# EAGLE design Tractive System Light Control Board (EAGLE 7.3.0)
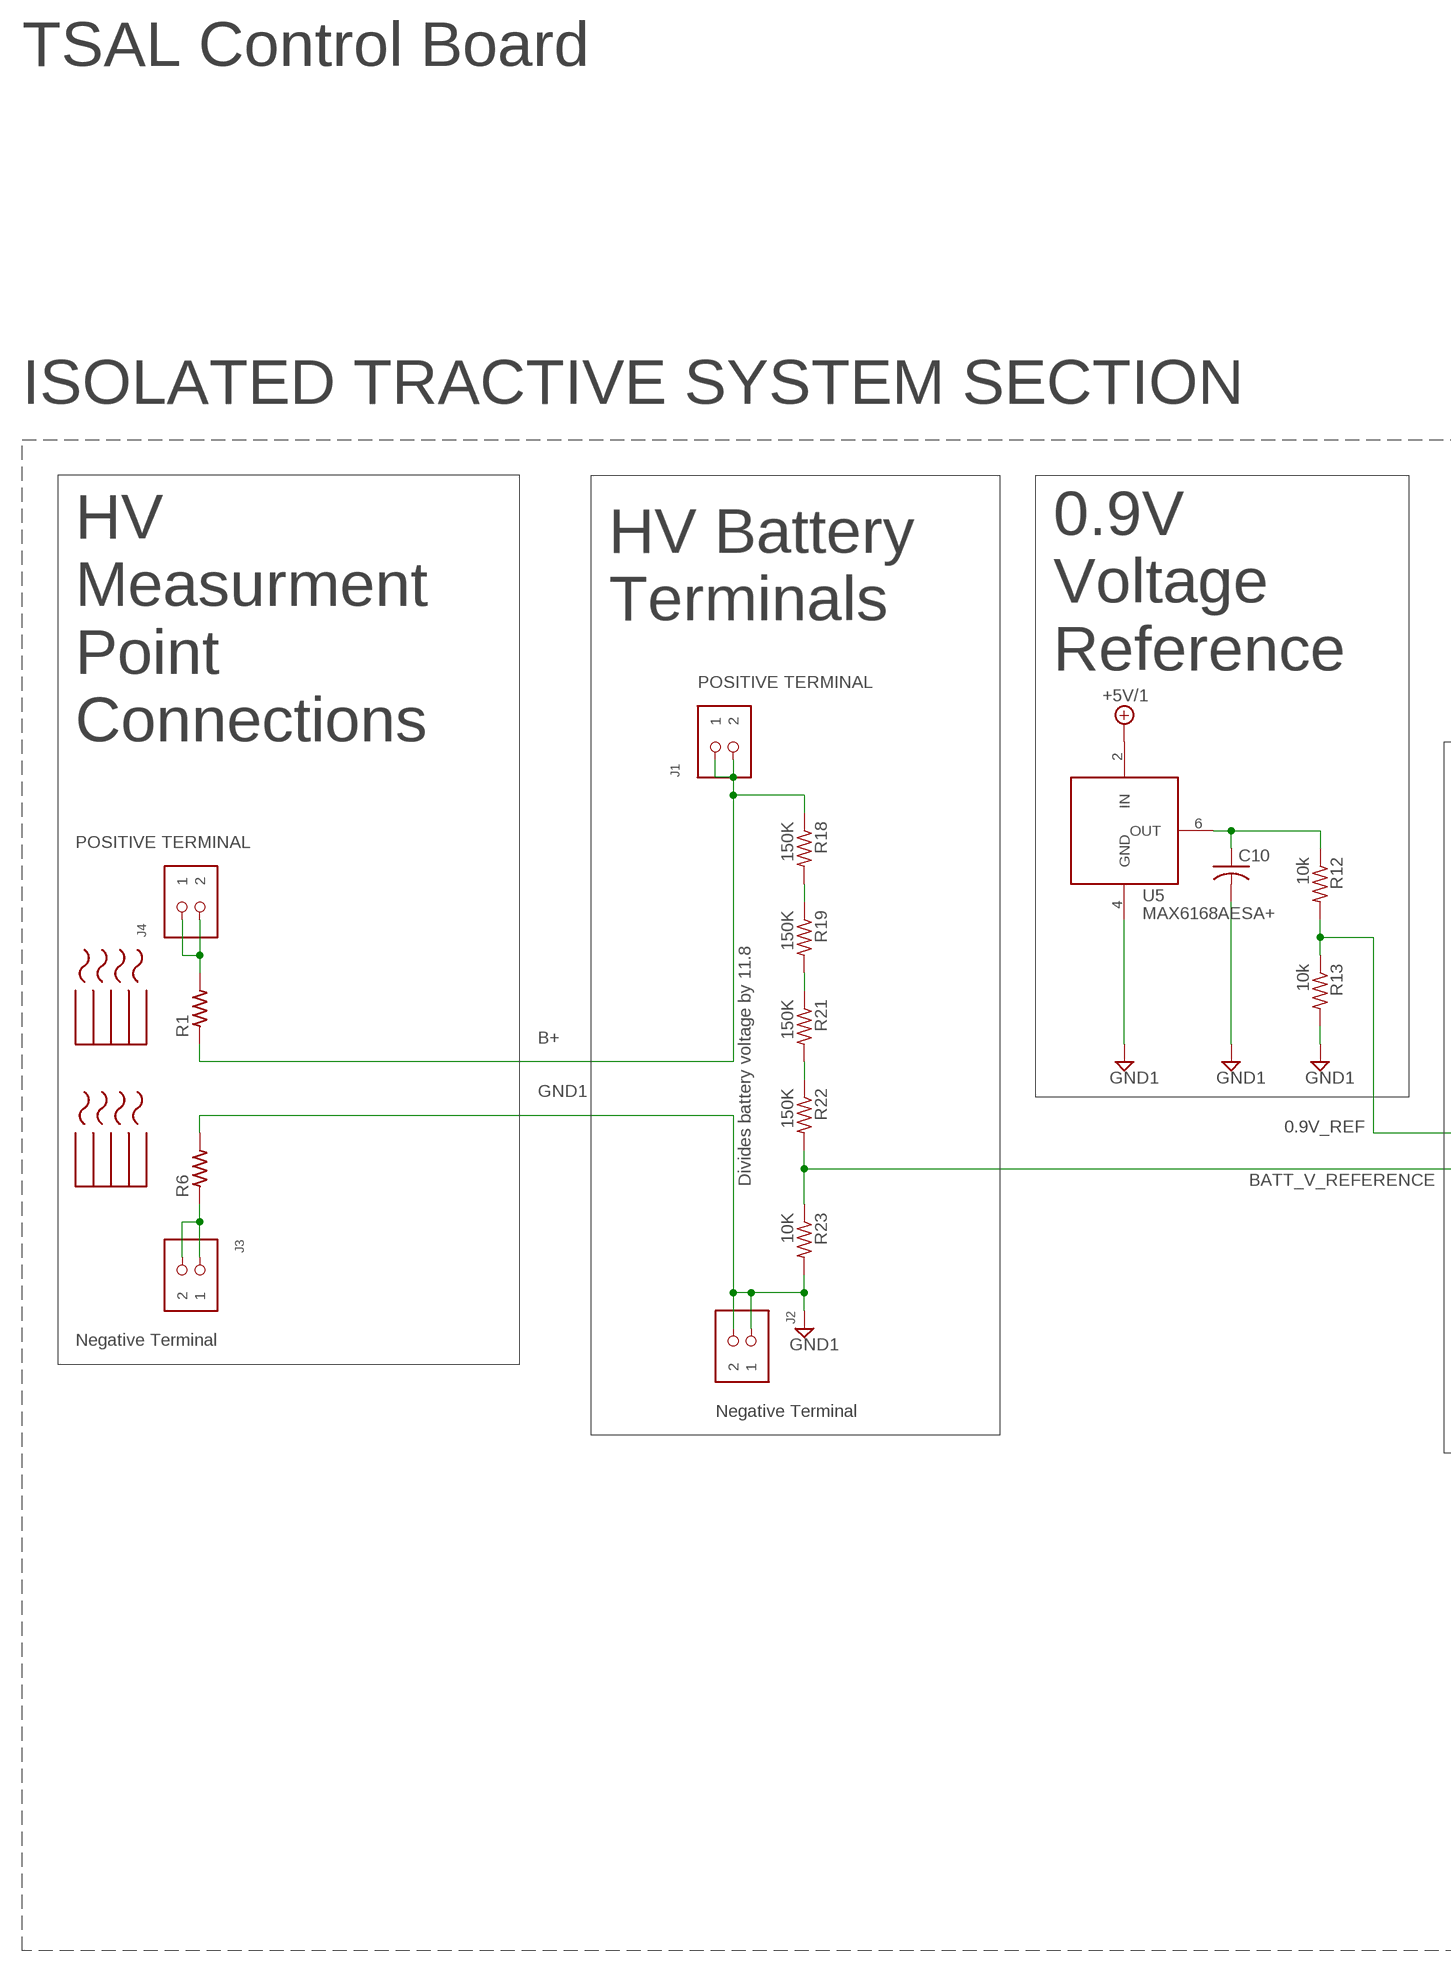
[diagram p0: schematic, sheet 1, part 1 of 2]
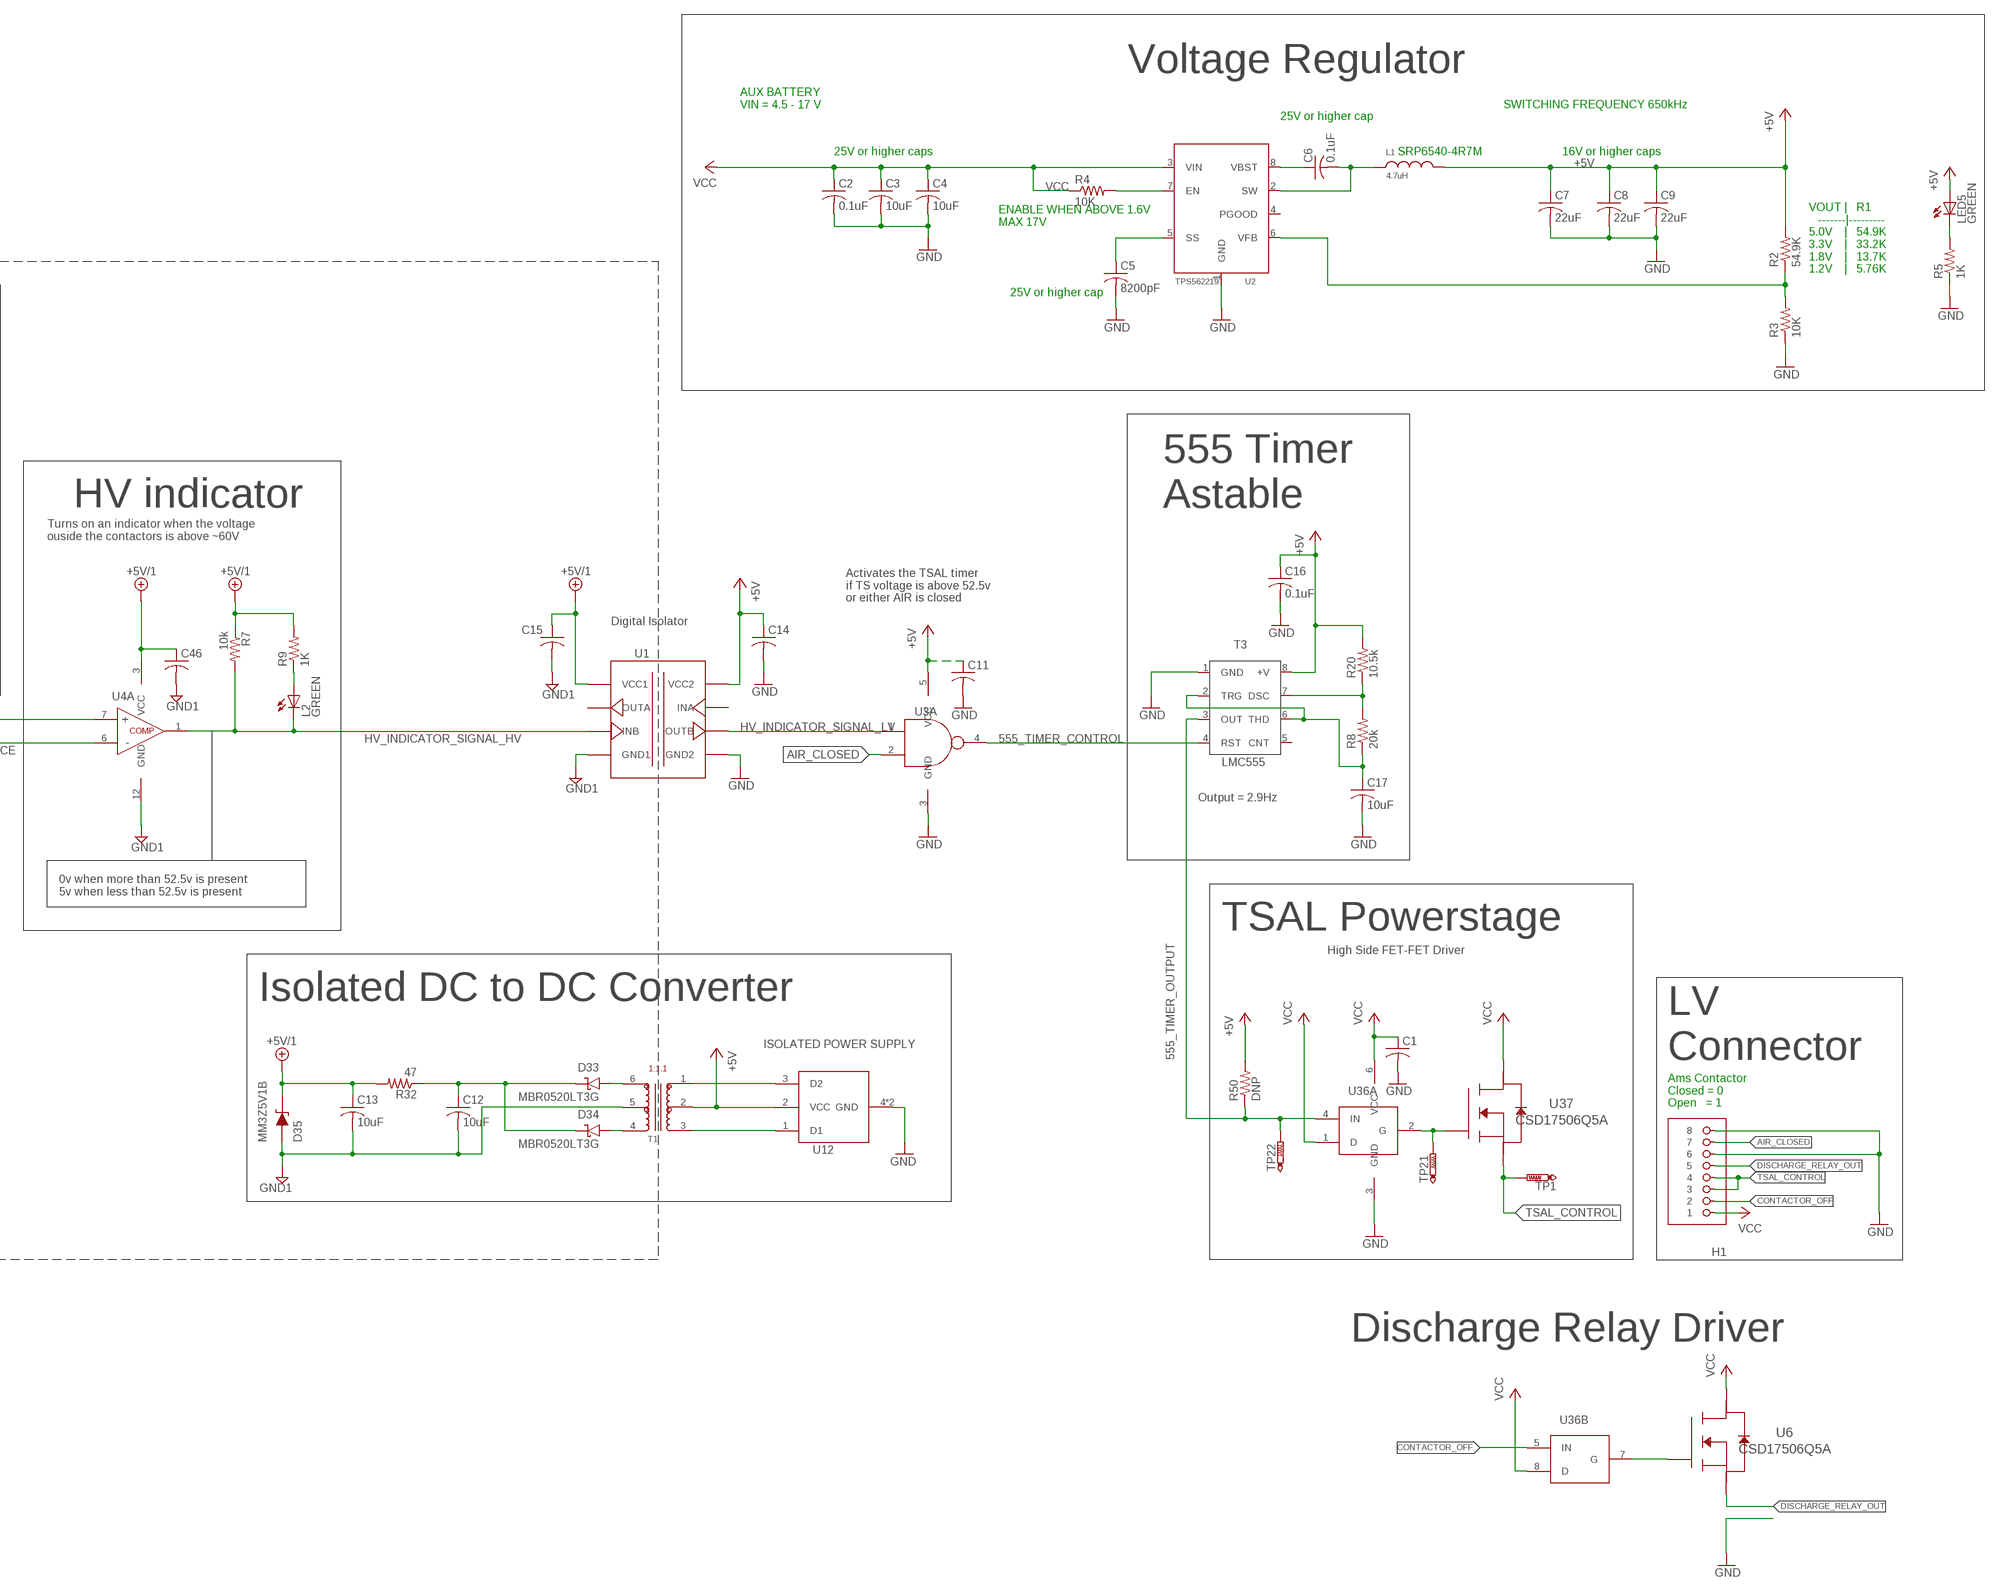
[diagram p1: schematic, sheet 1, part 2 of 2]

## Parts
C1  0.1uF  C-USC0805  [C0805]
C2  0.1uF  C-USC0805  [C0805]
C3  10uF  C-USC0805  [C0805]
C4  10uF  C-USC0805  [C0805]
C5  8200pF  C-USC0805  [C0805]
C6  0.1uF  C-USC0805  [C0805]
C7  22uF  C-USC0805  [C0805]
C8  22uF  C-USC0805  [C0805]
C9  22uF  C-USC0805  [C0805]
C10  0.1uF  C-USC0805  [C0805]
C11  0.1uF  C-USC0805  [C0805]
C12  10uF  C-USC0805  [C0805]
C13  10uF  C-USC0805  [C0805]
C14  0.1uF  C-USC0805  [C0805]
C15  0.1uF  C-USC0805  [C0805]
C16  0.1uF  C-USC0805  [C0805]
C17  10uF  C-USC0805  [C0805]
C46  0.1uF  C-USC0805  [C0805]
D33  MBR0520LT3G  [SOD-123]
D34  MBR0520LT3G  [SOD-123]
D35  MM3Z5V1B  [SOD323F]
H1  MOLEX_CLIKMATE-8-VERTICAL-5025841170  [MOLEX-CLIKMATE-8-VERTICAL-HEADER]
J1  MOLEX_CLICKMATE-2-VERTICAL  [MOLEX-CLIKMATE-2-VERTICAL-HEADER]
J2  MOLEX_CLICKMATE-2-VERTICAL  [MOLEX-CLIKMATE-2-VERTICAL-HEADER]
J3  MOLEX_CLICKMATE-2-VERTICAL  [MOLEX-CLIKMATE-2-VERTICAL-HEADER]
J4  MOLEX_CLICKMATE-2-VERTICAL  [MOLEX-CLIKMATE-2-VERTICAL-HEADER]
L1  4.7uH  SRP6540  [SRP6540]
L2  GREEN  LEDCHIPLED_0805  [CHIPLED_0805]
LED5  GREEN  LEDCHIPLED_0805  [CHIPLED_0805]
R1  RTO020F10001JTE3  [TO-220-2]
R2  54.9K  R-US_R0805  [R0805]
R3  10K  R-US_R0805  [R0805]
R4  10K  R-US_R0805  [R0805]
R5  1K  R-US_R0805  [R0805]
R6  RTO020F10001JTE3  [TO-220-2]
R7  10k  R-US_R0805  [R0805]
R8  20k  R-US_R0805  [R0805]
R9  1K  R-US_R0805  [R0805]
R12  10k  R-US_R0805  [R0805]
R13  10k  R-US_R0805  [R0805]
R18  150K  R-US_R0805  [R0805]
R19  150K  R-US_R0805  [R0805]
R20  10.5k  R-US_R0805  [R0805]
R21  150K  R-US_R0805  [R0805]
R22  150K  R-US_R0805  [R0805]
R23  10K  R-US_R0805  [R0805]
R32  47  R-US_R0805  [R0805]
R50  DNP  R-US_R0805  [R0805]
T1  750313734  WURTH-750313734  [WURTH-750313734]
T3  LMC555  LMC555DGK  [LMC555]
TP1  PTR1TP20R  [TP20R]
TP21  PTR1TP20R  [TP20R]
TP22  PTR1TP20R  [TP20R]
U1  ISO7221  [ISO722X]
U2  TPS562219  [TPS562219]
U3  SN74LVC1G00DRL  LL_NAND:SN74LVC1G00DRL  [LITTLE_LOGIC_BASIC_DRL]
U4  LM139  [D14]
U5  MAX6168AESA+  MAX616X  [SOIC-8]
U6  CSD17506Q5A  [SON_5X6]
U12  SN6501DBVR  SN6501  [SN6501DBV]
U36  LTC1155  [LT-SOL8]
U37  CSD17506Q5A  [SON_5X6]
U$1  581002B02500G  AAVID-581X  [AAVID-581X]
U$2  581002B02500G  AAVID-581X  [AAVID-581X]

## Nets
0.9V_REF: R12.2 R13.1 U4.7(A:+)
1.8V_REF: C10.1 R12.1 U5.6(OUT)
555_TIMER_CONTROL: T3.4(RST) U3.4(A:OUT)
555_TIMER_OUTPUT: R50.1 T3.3(OUT) TP22.TP U36.4(A:IN)
+5V: C7.1 C8.1 C9.1 C11.1 C14.1 C16.1 L1.P$2 LED5.A R2.2 R20.2 R50.2 T1.2 T3.8(+V) U1.P$8(VCC2) U3.5(VCC) U12.2(VCC)
+5V/1: C13.1 C15.1 C46.1 D35.CATHODE R7.1 R9.2 R32.2 U1.P$1(VCC1) U4.3(P:VCC) U5.2(IN)
AIR_CLOSED: H1.7 U3.2(A:IN2)
B+: J1.1 J1.2 R1.P$1 R18.1
BATT_V_REFERENCE: R22.2 R23.1 U4.6(A:-)
CONTACTOR_OFF: H1.2 U36.5(B:IN)
DISCHARGE_RELAY_OUT: H1.5 U6.1(S) U6.2(S) U6.3(S)
GND: C1.2 C2.2 C3.2 C4.2 C5.2 C7.2 C8.2 C9.2 C11.2 C14.2 C16.2 C17.2 H1.6 H1.8 R3.1 R5.1 T3.1(GND) U1.P$5(GND2) U2.1(GND) U3.3(GND) U12.4(GND) U12.5(GND) U36.3(P:GND)
GND1: C10.2 C12.2 C13.2 C15.2 C46.2 D35.ANODE J2.1 J2.2 R6.P$2 R13.2 R23.2 T1.5 U1.P$4(GND1) U4.12(P:GND) U5.4(GND)
HV_INDICATOR_SIGNAL_HV: L2.C R7.2 U1.P$3(INB) U4.1(A:OUT)
HV_INDICATOR_SIGNAL_LV: U1.P$6(OUTB) U3.1(A:IN1)
N$1: R4.2 U2.7(EN)
N$2: LED5.C R5.2
N$3: TP21.TP U36.2(A:G) U37.4(G)
N$4: L2.A R9.1
N$5: J4.1 J4.2 R1.P$2
N$6: J3.1 J3.2 R6.P$1
N$7: U6.4(G) U36.7(B:G)
N$12: R8.2 R20.1 T3.7(DSC)
N$13: C17.1 R8.1 T3.2(TRG) T3.6(THD)
N$18: R18.2 R19.1
N$26: R19.2 R21.1
N$27: R21.2 R22.1
N$31: T1.1 U12.3(D2)
N$40: T1.3 U12.1(D1)
N$41: D33.A T1.6
N$43: C12.1 D33.K D34.K R32.1
N$45: D34.A T1.4
SS_5V1: C5.1 U2.5(SS)
SW_5V2: C6.2 L1.P$1 U2.2(SW)
TSAL_CONTROL: H1.3 H1.4 TP1.TP U37.1(S) U37.2(S) U37.3(S)
VBST_5V1: C6.1 U2.8(VBST)
VCC: C1.1 C2.1 C3.1 C4.1 H1.1 R4.1 U2.3(VIN) U6.5(D) U6.6(D) U6.7(D) U6.8(D) U6.PAD1(D) U6.PAD(D) U6.VIA1(D) U6.VIA2(D) U6.VIA3(D) U6.VIA4(D) U6.VIA5(D) U6.VIA6(D) U6.VIA7(D) U6.VIA8(D) U6.VIA9(D) U36.1(A:D) U36.6(P:VCC) U36.8(B:D) U37.5(D) U37.6(D) U37.7(D) U37.8(D) U37.PAD1(D) U37.PAD(D) U37.VIA1(D) U37.VIA2(D) U37.VIA3(D) U37.VIA4(D) U37.VIA5(D) U37.VIA6(D) U37.VIA7(D) U37.VIA8(D) U37.VIA9(D)
VFB_5V1: R2.1 R3.2 U2.6(VFB)
Unconnected: T3.5(CNT) U1.P$2(OUTA) U1.P$7(INA) U2.4(PGOOD) U4.2(B:OUT) U4.4(B:-) U4.5(B:+) U4.8(C:-) U4.9(C:+) U4.10(D:-) U4.11(D:+) U4.13(D:OUT) U4.14(C:OUT)

## Notes on the sheet
- TSAL Control Board
- Voltage Regulator
- AUX BATTERY
  VIN = 4.5 - 17 V
- SWITCHING FREQUENCY 650kHz
- 25V or higher cap
- 25V or higher caps | SRP6540-4R7M | 16V or higher caps
- ENABLE WHEN ABOVE 1.6V
  MAX 17V
- ISOLATED TRACTIVE SYSTEM SECTION
- VOUT |   R1
     -------|---------
  5.0V    |   54.9K
  3.3V    |   33.2K
  1.8V    |   13.7K
  1.2V    |   5.76K
- 25V or higher cap
- 0.9V
  Voltage
  Reference
- HV Battery
  Terminals
- POSITIVE TERMINAL
- HV 
  Measurment
  Point 
  Connections
- HV indicator
- 555 Timer
  Astable
- Turns on an indicator when the voltage 
  ouside the contactors is above ~60V
- POSITIVE TERMINAL
- Activates the TSAL timer
  if TS voltage is above 52.5v
  or either AIR is closed
- Digital Isolator
- Divides battery voltage by 11.8
- Output = 2.9Hz
- Negative Terminal
- 0v when more than 52.5v is present
  5v when less than 52.5v is present
- Negative Terminal
- TSAL Powerstage
- High Side FET-FET Driver
- Isolated DC to DC Converter
- ISOLATED POWER SUPPLY
- LV
  Connector
- Ams Contactor 
  Closed = 0
  Open   = 1
- Discharge Relay Driver

## Library data of the parts
C1 C10 C11 C14 C15 C46 = rcl:C-US: CAPACITOR, American symbol; MPN: C1005X7R1E104K050BB; OC_NEWARK: 04X3227; PARTNO: GRM21BR71E104KA01L
C2 C6 = adafruit:C-US: CAPACITOR, American symbol; PARTNO: GRM21BR71E104KA01L
C3 C4 C17 = adafruit:C-US: CAPACITOR, American symbol; PARTNO: GRM21BR61E106KA73L
C5 = adafruit:C-US: CAPACITOR, American symbol; PARTNO: C0805C822K5RACTU
C7-C9 = adafruit:C-US: CAPACITOR, American symbol; PARTNO: C2012JB1E226M125AC
C12 C13 = rcl:C-US: CAPACITOR, American symbol; MPN: C1005X7R1E104K050BB; OC_NEWARK: 04X3227; PARTNO: GRM21BR61E106KA73L
C16 = adafruit:C-US: CAPACITOR, American symbol; PARTNO: 08053C104KAT2A
D33 D34 = FormE:MBR0520LT3G; PARTNO: MBR0520LT3G
D35 = FormE:MM3Z5V1B; PARTNO: MM3Z5V1B
H1 = FormE:MOLEX_CLIKMATE-8-VERTICAL-5025841170: 505405-0860; PARTNO: 5025840870; VALUE: 5025841170
J1-J4 = FormE:MOLEX_CLICKMATE-2-VERTICAL: 5025840270; PARTNO: 5025840270
L1 = FormE:SRP6540; PARTNO: SRP6540-4R7M
L2 LED5 = FormE:LED: LED OSRAM: - CHIPLED LG R971, LG N971, LY N971, LG Q971, LY Q971, LO R971, LY R971 LH N974, LH R974 LS Q976, LO Q976, LY Q976 LO Q996 - Hyper CHIPLED LW Q18S LB Q993, LB Q99A, LB R99A - SideLED LS A670, LO A670, LY A670, LG A670, LP A670 LB A673, LV A673, LT A673, LW A673 LH A674 LY A675 LS A676, LA A676, LO A676, LY A676, LW A676 LS A679, LY A679, LG A679 - Hyper Micro SIDELED® LS Y876, LA Y876, LO Y876, LY Y876 LT Y87S - SmartLED LW L88C, LW L88S LB L89C, LB L89S, LG L890 LS L89K, LO L89K, LY L89K LS L896, LA L896, LO L896, LY L896 - TOPLED LS T670, LO T670, LY T670, LG T670, LP T670 LSG T670, LSP T670, LSY T670, LOP T670, LYG T670 LG T671, LOG T671, LSG T671 LB T673, LV T673, LT T673, LW T673 LH T674 LS T676, LA T676, LO T676, LY T676, LB T676, LH T676, LSB T676, LW T676 LB T67C, LV T67C, LT T67C, LS T67K, LO T67K, LY T67K, LW E67C LS E67B, LA E67B, LO E67B, LY E67B, LB E67C, LV E67C, LT E67C LW T67C LS T679, LY T679, LG T679 LS T770, LO T770, LY T770, LG T770, LP T770 LB T773, LV T773, LT T773, LW T773 LH T774 LS E675, LA E675, LY E675, LS T675 LS T776, LA T776, LO T776, LY T776, LB T776 LHGB T686 LT T68C, LB T68C - Hyper Mini TOPLED® LB M676 - Mini TOPLED Santana® LG M470 LS M47K, LO M47K, LY M47K Source: http://www.osram.convergy.de/; PARTNO: 598-8170-107F
R1 R6 = FormE:RTO020F10001JTE3: 10K Resistor with heatsink- Max 500V, 20W; PARTNO: RTO020F10001JTE3; VALUE: RT20J-10K-ND
R2 = adafruit:R-US_: RESISTOR, American symbol; PARTNO: ERA-6AEB5492V
R3 R4 R7 R12 R13 R23 = adafruit:R-US_: RESISTOR, American symbol; PARTNO: ERJ-6ENF1002V
R5 R9 = adafruit:R-US_: RESISTOR, American symbol; PARTNO: ERJ-6ENF1001V
R8 = adafruit:R-US_: RESISTOR, American symbol; PARTNO: ERJ-6ENF2002V
R18 R19 R21 R22 = adafruit:R-US_: RESISTOR, American symbol; PARTNO: ERJ-6ENF1503V
R20 = adafruit:R-US_: RESISTOR, American symbol; PARTNO: ERJ-6ENF1052V
R32 = rcl:R-US_: RESISTOR, American symbol; PARTNO: ERA-6AEB470V
R50 = rcl:R-US_: RESISTOR, American symbol
T1 = FormE:WURTH-750313734; PARTNO: 750313734
T3 = FormE:LMC555: 555 Timer; PARTNO: LMC555CMM/NOPB
TP1 TP21 TP22 = testpad:PTR1: TEST PIN
U1 = FormE:ISO7221; PARTNO: ISO7221CDR
U2 = FormE:TPS562219; PARTNO: TPS562219DDFT
U3 = FormE:LL_NAND:SN74LVC1G00: Little Logic NAND Gate; PARTNO: SN74LVC1G00DRLR
U4 = FormE:LM139; DATASHEETURL: http://www.ti.com/lit/gpn/LM139; DESCRIPTION: Quad Differential Comparator; FAMILY_NAME: COMPARATOR; GENERIC_PART_NUMBER: LM139; INDUSTRY_STD_PKG_TYPE: SOIC; MANUFACTURER: Texas Instruments; PACKAGE_DESIGNATOR: D; PARTNO: LM139DR; PIN_COUNT: 14
U5 = FormE:MAX616X; PARTNO: MAX6168AESA+
U6 = FormE:CSD17506Q5A
U12 = FormE:SN6501; PARTNO: SN6501DBVR
U36 = FormE:LTC1155; PARTNO: LTC1155CS8#PBF
U37 = FormE:CSD17506Q5A; PARTNO: CSD17506Q5A
U$1 U$2 = FormE:AAVID-581X; PARTNO: 581002B02500G

## Board
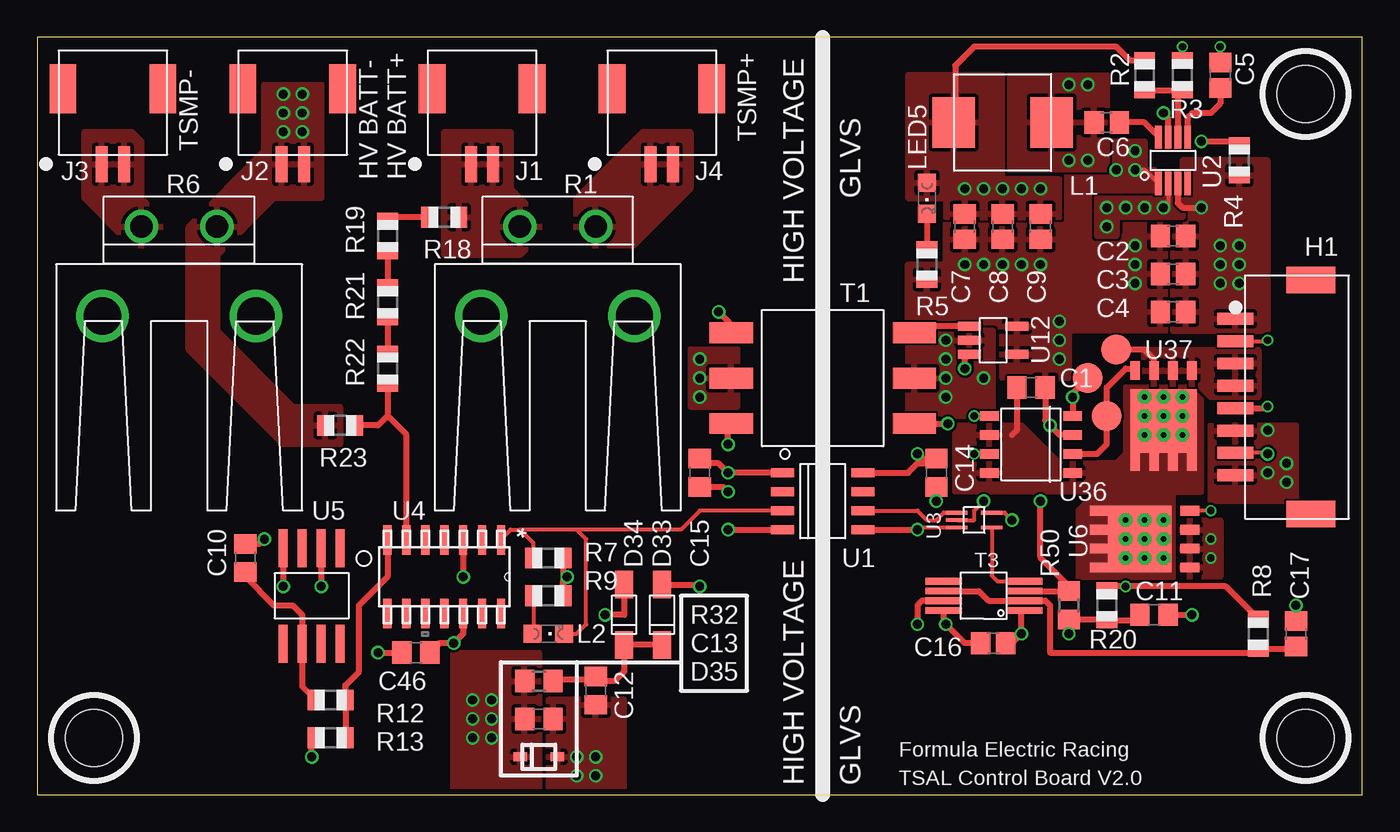
[diagram p2: board, top side]
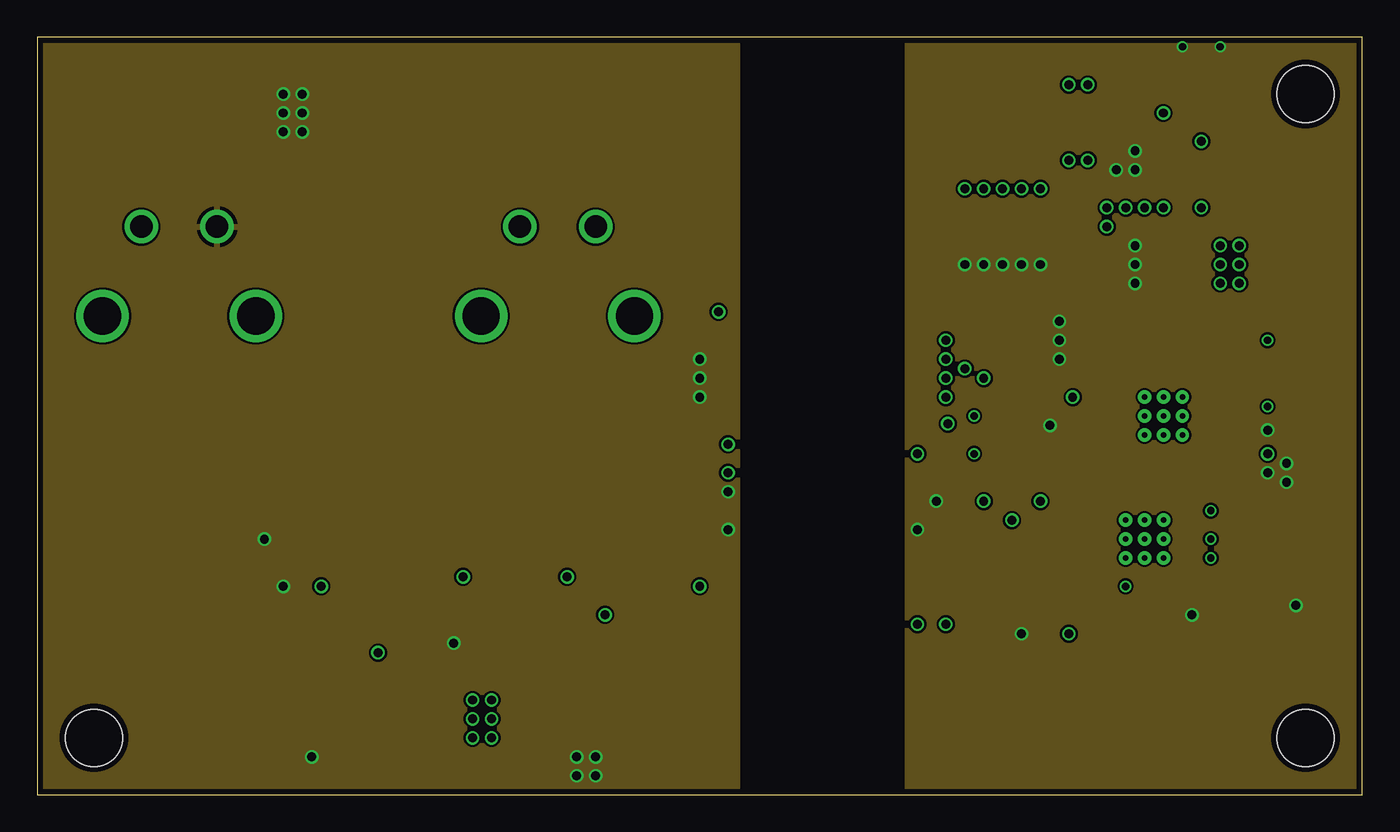
[diagram p3: board, inner layer Route2]
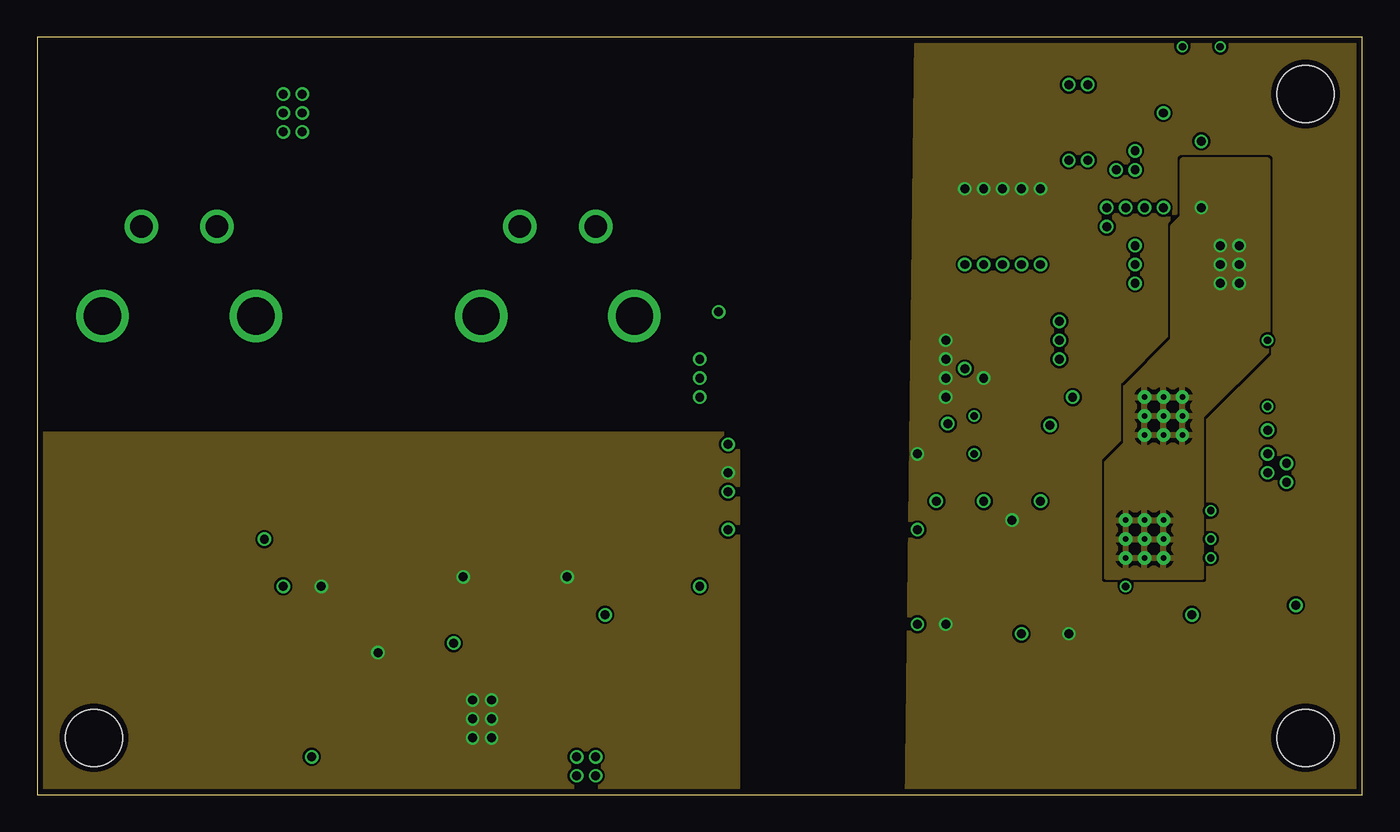
[diagram p4: board, inner layer Route15]
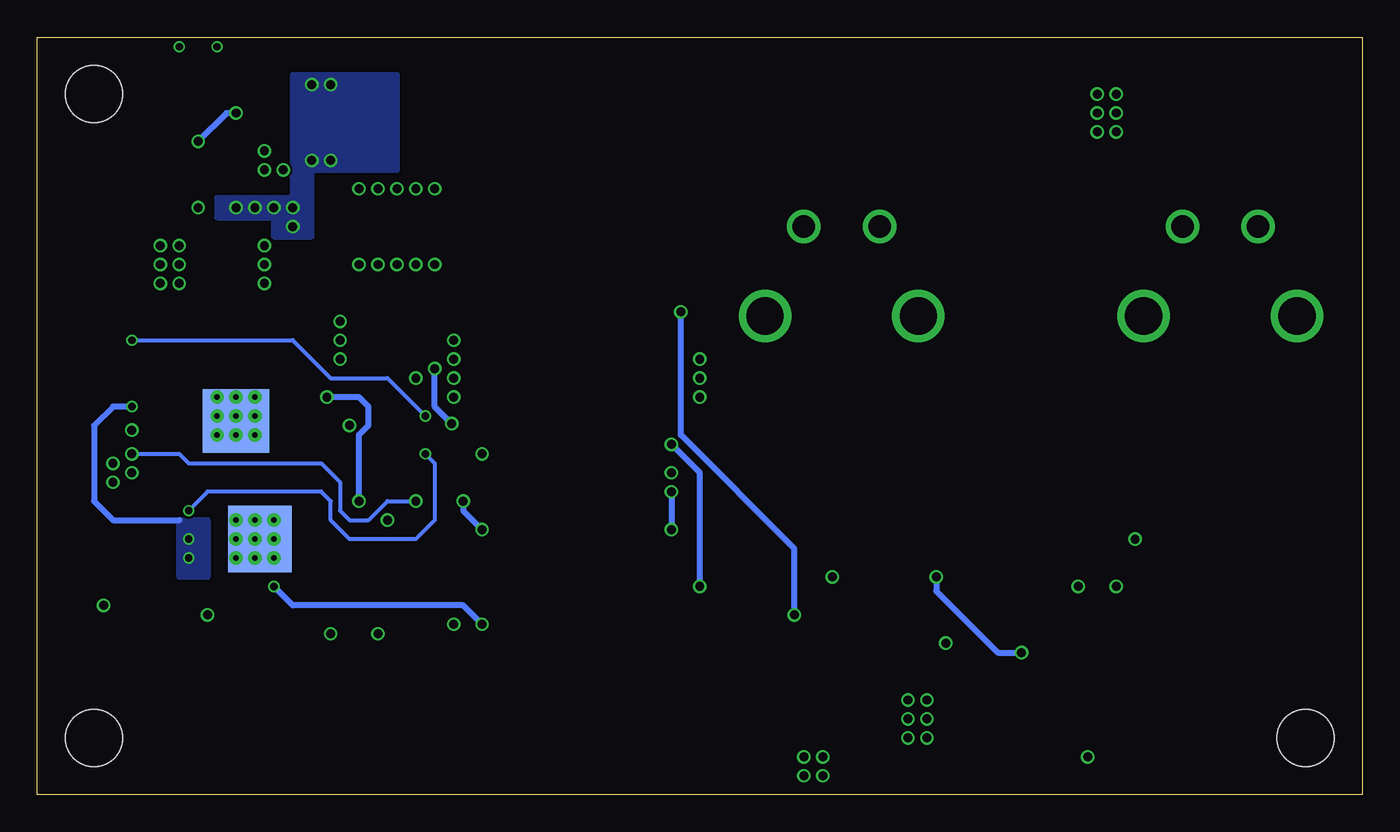
[diagram p5: board, bottom side, seen from below]

Size 88.9 x 50.8 mm. Coordinates in mm from the lower left corner, seen from the top.
Outline: 0,0 88.9,0 88.9,50.8 0,50.8 0,0
Copper layers (1*2*15*16): Top 0.035559375mm / dielectric 0.17018125mm / Route2 0.01778125mm / dielectric 47mil / Route15 0.01778125mm / dielectric 0.17018125mm / Bottom 0.035559375mm
Design rules "SierraCircuits-4layer": minimum track width 5mil, minimum drill 10mil, track to track 6mil, track to pad 6mil, pad to pad 6mil, via to via 6mil, smd to smd 6mil, copper to edge 15mil, drill to drill 6mil, minimum pad ring 5mil, minimum via ring 5mil, stop-mask expansion 4mil, vias tented up to drill 0mil, thermal gap 10mil
Holes 3.81 mm at 85.09,46.99 3.81,3.81 85.09,3.81

### Footprints (pad centres in the part's own frame; a part is rotated, then mirrored left to right if it is on the bottom)
C0805 = smd 1.3 x 1.5: 1 -0.95,0; 2 0.95,0
C0805' = smd 1.3 x 1.5: 1 -0.85,0; 2 0.85,0
SOD-123 = smd 1.2 x 1.85: A 0,-2.025; K 0,2.025
SOD323F = smd 0.9 x 0.6: ANODE 1.25,0; CATHODE -1.25,0
MOLEX-CLIKMATE-8-VERTICAL-HEADER = smd 0.8 x 2.4: 1 5.25,4.064; 2 3.75,4.064; 3 2.25,4.064; 4 0.75,4.064; 5 -0.75,4.064; 6 -2.25,4.064; 7 -3.75,4.064; 8 -5.25,4.064 | smd 1.8 x 3.3: M1 7.85,-0.986; M2 -7.85,-0.986
MOLEX-CLIKMATE-2-VERTICAL-HEADER = smd 0.8 x 2.4: 1 0.75,4.064; 2 -0.75,4.064 | smd 1.8 x 3.3: M1 3.35,-0.986; M2 -3.35,-0.986
SRP6540 = smd 2.85 x 3.4: P$1 -3.275,0; P$2 3.275,0
CHIPLED_0805 = smd 1.2 x 1.2: A 0,-1.05; C 0,1.05
TO-220-2 = drill 1.5: P$1 2.54,0; P$2 -2.54,0
R0805 = smd 1.1 x 1.4: 1 -1,0; 2 1,0
R0805' = smd 1.3 x 1.5: 1 -0.95,0; 2 0.95,0
WURTH-750313734 = smd 2.905 x 1.397: 1 -6.152,3.048; 2 -6.152,0; 3 -6.152,-3.048; 4 6.152,-3.048; 5 6.152,0; 6 6.152,3.048
LMC555 = smd 2.45 x 0.45: 1 -2.7,0.975; 2 -2.7,0.325; 3 -2.7,-0.325; 4 -2.7,-0.975; 5 2.7,-0.975; 6 2.7,-0.325; 7 2.7,0.325; 8 2.7,0.975
TP20R = smd 2 x 2: TP 0,0
ISO722X = smd 0.6 x 1.55: P$1 -1.905,-2.7; P$2 -0.635,-2.7; P$3 0.635,-2.7; P$4 1.905,-2.7; P$5 1.905,2.7; P$6 0.635,2.7; P$7 -0.635,2.7; P$8 -1.905,2.7
TPS562219 = smd 1.55 x 0.45: 1 -1.55,0.975; 2 -1.55,0.325; 3 -1.55,-0.325; 4 -1.55,-0.975; 5 1.55,-0.975; 6 1.55,-0.325; 7 1.55,0.325; 8 1.55,0.975
LITTLE_LOGIC_BASIC_DRL = smd 1.45 x 0.25: 1 -1.175,0.5; 2 -1.175,0; 3 -1.175,-0.5; 4 1.175,-0.5; 5 1.175,0.5
D14 = smd 1.981 x 0.559: 1 -2.464,3.81; 2 -2.464,2.54; 3 -2.464,1.27; 4 -2.464,0; 5 -2.464,-1.27; 6 -2.464,-2.54; 7 -2.464,-3.81; 8 2.464,-3.81; 9 2.464,-2.54; 10 2.464,-1.27; 11 2.464,0; 12 2.464,1.27; 13 2.464,2.54; 14 2.464,3.81
SOIC-8 = smd 0.6 x 2.55: 1 -1.905,-3.2; 2 -0.635,-3.2; 3 0.635,-3.2; 4 1.905,-3.2; 5 1.905,3.2; 6 0.635,3.2; 7 -0.635,3.2; 8 -1.905,3.2
SON_5X6 = smd 1.27 x 0.66: 1 3.048,-1.905; 2 3.048,-0.635; 3 3.048,0.635; 4 3.048,1.905; 5 -3.048,1.905; 6 -3.048,0.635; 7 -3.048,-0.635; 8 -3.048,-1.905 | smd 4.267 x 4.47 bottom: PAD -0.33,0 | smd 4.267 x 4.47: PAD1 -0.33,0 | drill 0.381 pad 0.889: VIA1 -1.27,1.27; VIA2 0,1.27; VIA3 1.27,1.27; VIA4 -1.27,0; VIA5 0,0; VIA6 1.27,0; VIA7 -1.27,-1.27; VIA8 0,-1.27; VIA9 1.27,-1.27
SN6501DBV = smd 0.6 x 1.55: 1 -0.95,-1.6; 2 0,-1.6; 3 0.95,-1.6; 4 0.95,1.6; 5 -0.95,1.6
LT-SOL8 = smd 1.27 x 0.635: 1 -2.794,1.905; 2 -2.794,0.635; 3 -2.794,-0.635; 4 -2.794,-1.905; 5 2.794,-1.905; 6 2.794,-0.635; 7 2.794,0.635; 8 2.794,1.905
AAVID-581X = drill 2.5: P$1 -5.144,5.994; P$2 5.144,5.994

### Placement (x,y rotation side)
C1  66.67,27.3 0 top
C2  0.1uF  [C0805']  76.2,37.47 180 top
C3  10uF  [C0805']  76.2,34.92 180 top
C4  10uF  [C0805']  76.2,32.38 180 top
C5  8200pF  [C0805']  79.38,48.26 90 top
C6  0.1uF  [C0805']  71.75,45.09 180 top
C7  22uF  [C0805']  62.23,38.1 270 top
C8  22uF  [C0805']  64.77,38.1 270 top
C9  22uF  [C0805']  67.31,38.1 270 top
C10  13.97,15.88 90 top
C11  74.93,12.06 0 top
C12  37.47,6.99 270 top
C13  33.66,5.08 0 top
C14  60.33,21.59 270 top
C15  44.45,21.59 270 top
C16  0.1uF  [C0805']  64.14,10.16 0 top
C17  10uF  [C0805']  84.45,10.79 90 top
C46  25.4,9.53 0 top
D33  41.91,12.06 180 top
D34  39.37,12.06 180 top
D35  33.66,2.54 0 top
H1  84.45,26.67 90 top
J1  29.84,46.35 180 top
J2  17.14,46.35 180 top
J3  5.08,46.35 180 top
J4  41.91,46.35 180 top
L1  64.77,45.09 180 top
L2  34.29,10.79 270 top
LED5  59.69,40.01 180 top
R1  34.92,38.1 180 top
R2  74.3,48.26 90 top
R3  76.83,48.26 270 top
R4  80.64,42.55 90 top
R5  59.69,35.56 90 top
R6  9.53,38.1 180 top
R7  34.29,15.88 180 top
R8  81.92,10.79 90 top
R9  34.29,13.34 0 top
R12  19.68,6.35 0 top
R13  19.68,3.81 180 top
R18  27.3,38.73 180 top
R19  23.5,37.47 270 top
R20  71.75,12.7 270 top
R21  23.5,33.02 270 top
R22  23.5,28.57 270 top
R23  20.32,24.77 180 top
R32  47  [R0805']  33.66,7.62 180 top
R50  DNP  [R0805']  69.22,12.7 270 top
T1  52.7,27.94 180 top
T3  63.5,13.34 180 top
TP1  72.39,29.84 0 top
TP21  71.75,25.4 90 top
TP22  70.48,27.94 90 top
U1  52.7,19.68 270 top
U2  76.2,42.55 90 top
U3  62.87,18.41 0 top
U4  27.3,14.61 270 top
U5  18.41,13.34 180 top
U6  74.3,17.14 0 top
U12  64.14,30.48 270 top
U36  66.67,23.5 180 top
U37  75.56,25.4 90 top
U$1  9.53,38.1 180 top
U$2  34.92,38.1 180 top

### Tracks (layer width: path | path; a pad name or v marks a point on that pad's centre or on a via)
0.9V_REF
  Top 0.406: R13.1 R12.2 20.68,7.35 21.59,8.26 21.59,12.7 23.5,14.61 U4.7
1.8V_REF
  Top 0.406: C10.1 13.97,14.61 15.88,12.7 17.14,12.7 17.78,12.06 U5.6 17.78,7.25 R12.1
555_TIMER_CONTROL
  Top 0.254: U3.4 64.04,14.7 64.43,14.31 T3.4
555_TIMER_OUTPUT  (via drill 0.6)
  Top 0.406: TP22.TP 69.47,26.92 v69.47,26.67 U36.4 | T3.3 69.2,13.66 R50.1 69.22,13.97 67.31,15.88 v67.31,19.68
  Bottom 0.406: v67.31,19.68 67.31,24.13 66.67,24.77 66.67,26.04 67.31,26.67 v69.47,26.67
+5V  (via drill 0.6)
  Top 0.254: U3.5 64.91,18.91 v65.41,18.41
  Top 0.406: L1.P$2 61.59,45.19 61.59,48.9 62.87,50.16 72.39,50.16 73.3,49.26 R2.2 | U1.P$8 58.42,21.59 59.05,22.23 60.01,22.23 C14.1 59.38,22.54 v59.05,22.86 | v69.22,10.79 R50.2 72.34,11.75 72.39,11.7 | T3.8 60.8,11.59 v60.96,11.43 62.23,10.16 C16.1 | R20.2 72.39,11.7 | 74.3,12.06 73.66,11.74 | 72.39,11.7 73.61,11.7 73.66,11.74 | 73.66,11.74 C11.1
  other vias: 67.31,40.64 66.04,40.64 64.77,40.64 63.5,40.64 62.23,40.64 60.96,27.94 60.96,30.48 60.96,29.21 60.96,26.67 63.5,27.94
  pour Top: 64.77,48.26 58.42,48.26 58.42,40.01 60.96,40.01 60.96,38.73 68.58,38.73 68.58,41.27 64.77,41.27
  pour Route15 (rank 5): 59.05,50.8 88.9,51.44 88.9,-0.64 58.42,-0.64
  pour Top (rank 2): 58.42,25.4 64.14,25.4 64.14,31.11 58.42,31.11
+5V/1  (via drill 0.6)
  Top 0.406: U1.P$1 v46.35,21.59 45.72,22.23 44.77,22.23 C15.1 | R7.1 R9.2 35.29,14.34 v35.56,14.61 | U4.3 v28.57,14.61 | v22.86,9.53 C46.1 | U5.2 v19.05,13.97
  Bottom 0.406: v28.57,14.61 28.57,13.65 C46.1 v22.86,9.53
  other vias: 30.48,5.08 30.48,6.35 29.21,6.35 29.21,5.08 29.21,3.81 30.48,3.81
  pour Route15: 46.99,-0.64 46.99,24.13 0,24.13 0,0
  pour Top: 33.66,9.53 33.66,0 27.94,0 27.94,9.53
AIR_CLOSED  (via drill 0.6)
  Top 0.254: U3.2 62.87,18.41 62.87,19.05 v63.5,19.68 | v82.55,22.86 82.49,22.92 H1.7
  Bottom 0.254: v82.55,22.86 79.38,22.86 78.74,22.23 69.85,22.23 68.58,20.95 68.58,19.05 67.94,18.41 66.67,18.41 65.41,19.68 v63.5,19.68
B+
  pour Top: 27.3,44.45 31.75,44.45 31.75,40.64 33.66,38.73 33.66,37.47 32.38,36.2 27.3,36.2
BATT_V_REFERENCE
  Top 0.406: R22.2 23.5,25.4 | 23.5,25.4 22.86,24.77 R23.1 | U4.6 24.77,24.13 23.5,25.4
CONTACTOR_OFF  (via drill 0.5)
  Top 0.254: H1.2 82.49,30.42 v82.55,30.48 | v62.87,25.4 U36.5
  Bottom 0.254: v82.55,30.48 71.75,30.48 69.22,27.94 65.41,27.94 v62.87,25.4
DISCHARGE_RELAY_OUT  (via drill 0.5)
  Top 0.406: H1.5 82.44,25.92 v82.55,26.04
  Bottom 0.406: v82.55,26.04 83.82,26.04 85.09,24.77 85.09,19.68 83.82,18.41 79.38,18.41
  other vias: 78.74,15.88 78.74,17.14
  pour Top: 76.83,18.41 79.38,18.41 79.38,14.61 76.83,14.61
  pour Bottom: 79.38,18.41 77.47,18.41 77.47,14.61 79.38,14.61
GND  (via drill 0.5, 0.6)
  Top 0.254: U2.1 74.31,41.91 v73.66,41.91 | U3.3 59.19,17.91 | 84.45,12.06 C17.2
  Top 0.406: U1.P$5 v59.05,17.78 59.19,17.91 | U36.3 68.58,24.13 v67.94,24.77 67.62,25.09 C1.2 | C14.2 v60.33,19.68 | C16.2 65.41,10.16 v66.04,10.79 66.04,12.2 T3.1 | 84.45,12.06 v84.45,12.7 | C11.2 v77.47,12.06 | R3.1 v76.83,50.16 | C5.2 v79.38,50.16
  Bottom 0.406: v60.33,19.68 60.33,19.05 v59.05,17.78
  other vias: 67.31,35.56 66.04,35.56 64.77,35.56 63.5,35.56 62.23,35.56 73.66,34.29 73.66,35.56 73.66,36.83 73.66,43.18 72.39,41.91 82.55,21.59 68.58,31.75 68.58,30.48 68.58,29.21 83.82,22.23 83.82,20.95 82.55,24.45
  pour Top (rank 4): 58.42,35.56 60.96,35.56 60.96,38.73 68.58,38.73 68.58,42.55 71.75,42.55 71.75,43.81 74.3,43.81 74.3,41.91 74.93,41.91 74.93,40.01 71.12,40.01 71.12,37.47 73.03,37.47 73.03,38.73 76.2,38.73 76.2,31.11 58.42,31.11
  pour Route2: 58.42,51.44 89.53,51.44 89.53,0 58.42,0
  pour Top (rank 4): 78.74,24.77 84.45,24.77 84.45,19.68 78.74,19.68
  pour Top: 64.77,32.38 69.22,32.38 69.22,27.94 64.77,27.94
GND1  (via drill 0.6)
  Top 0.406: v46.35,17.78 U1.P$4 | C15.2 46.03,20.64 v46.35,20.32 | U4.12 28.57,10.79 v27.94,10.16 26.98,10.16 C46.2 | U5.4 v16.51,13.97 | C10.2 14.92,16.82 v15.24,17.14 | v18.41,2.54 18.41,3.54 R13.2
  Bottom 0.406: v46.35,20.32 v46.35,17.78
  other vias: 44.45,27.94 44.45,29.21 44.45,26.67 36.2,2.54 37.47,2.54 37.47,1.27 36.2,1.27 16.51,44.45 17.78,44.45 17.78,45.72 16.51,45.72 16.51,46.99 17.78,46.99
  pour Route2: 46.99,50.8 0,50.8 0,0 46.99,0
  pour Top: 46.99,26.04 46.99,29.84 43.81,29.84 43.81,26.04
  pour Top: 39.37,6.35 34.29,6.35 34.29,0 39.37,0
  pour Top: 15.24,47.62 19.05,47.62 19.05,40.01 15.88,40.01 12.06,36.2 12.06,31.11 17.14,26.04 20.32,26.04 20.32,23.5 16.51,23.5 10.16,29.84 10.16,38.1 15.24,43.18
HV_INDICATOR_SIGNAL_HV
  Top 0.254: U1.P$3 44.45,19.05 43.18,17.78 36.2,17.78 | 36.2,17.78 32.38,17.78 | R7.2 33.29,16.88 32.38,17.78 | L2.C 36.2,10.79 36.83,11.43 36.83,17.14 36.2,17.78 | U4.1 31.11,17.14 31.75,17.78 32.38,17.78
HV_INDICATOR_SIGNAL_LV
  Top 0.254: U1.P$6 59.05,19.05 59.69,18.41 60.33,18.41 60.83,18.91 U3.1
N$1  (via drill 0.6)
  Top 0.406: U2.7 75.88,45.41 v75.56,45.72 | v78.11,43.81 80.38,43.81 R4.2
  Bottom 0.406: v75.56,45.72 76.2,45.72 v78.11,43.81
N$2
  Top 0.406: LED5.C R5.2
N$3
  Top 0.406: U36.2 71.12,22.86 71.75,23.5 TP21.TP 71.75,27.3 73.03,28.57 73.53,28.57 U37.4
N$4
  Top 0.254: R9.1 33.29,10.85 L2.A
N$5
  pour Top: 40.64,44.45 43.81,44.45 43.81,40.64 40.01,36.83 36.2,36.83 36.2,40.01
N$6
  pour Top: 3.17,44.45 6.35,44.45 6.99,43.81 6.99,40.01 8.26,38.73 8.26,37.47 7.62,36.83 6.35,36.83 3.17,40.01
N$7  (via drill 0.5)
  Top 0.254: U36.7 v62.87,22.86 | v78.74,19.05 U6.4
  Bottom 0.254: v62.87,22.86 62.23,22.23 62.23,18.41 63.5,17.14 67.94,17.14 69.22,18.41 69.22,19.68 69.85,20.32 77.47,20.32 v78.74,19.05
N$12  (via drill 0.5, 0.6)
  Top 0.406: T3.7 59.37,13.01 59.05,12.7 v59.05,11.43 | R8.2 79.74,13.97 v73.03,13.97 72.03,13.97 R20.1
  Bottom 0.406: v59.05,11.43 60.33,12.7 71.75,12.7 v73.03,13.97
N$13
  Top 0.406: T3.6 63.17,13.66 63.83,13.01 T3.2 67.64,13.01 67.94,12.7 67.94,9.53 81.64,9.53 R8.1 84.31,9.79 C17.1
N$18
  Top 0.406: R18.2 23.77,38.73 R19.1
N$26
  Top 0.406: R19.2 R21.1
N$27
  Top 0.406: R21.2 R22.1
N$31  (via drill 0.6)
  Top 0.406: T1.1 v61.09,24.89 | v62.23,28.57 62.23,29.23 U12.3
  Bottom 0.406: v61.09,24.89 62.23,26.04 v62.23,28.57
N$40
  Top 0.406: U12.1 59.3,31.43 T1.3
N$41  (via drill 0.6)
  Top 0.406: D33.A 44.33,14.09 v44.45,13.97 | v46.35,23.5 46.35,24.69 T1.6
  Bottom 0.406: v44.45,13.97 44.45,21.59 v46.35,23.5
N$43
  Top 0.406: D33.K D34.K 39.37,8.26 38.73,7.62 37.78,7.62 C12.1 37.02,7.93 36.83,7.75 34.73,7.75 R32.1
N$45  (via drill 0.6)
  Top 0.406: T1.4 46.43,31.11 46.43,31.68 v45.72,32.38 | D34.A 39.37,12.06 v38.1,12.06
  Bottom 0.406: v38.1,12.06 38.1,16.51 45.72,24.13 v45.72,32.38
SS_5V1
  Top 0.406: C5.1 79.38,46.35 78.74,45.72 77.47,45.72 77.17,45.42 U2.5
SW_5V2  (via drill 0.6)
  Top 0.254: U2.2 75.88,39.68 v75.56,39.37
  other vias: 70.48,47.62 71.75,39.37 69.22,47.62 73.03,39.37 74.3,39.37 71.75,38.1 69.22,42.55 70.48,42.55
  pour Bottom: 76.83,40.01 76.83,38.73 73.03,38.73 73.03,37.47 70.48,37.47 70.48,41.91 64.77,41.91 64.77,48.26 71.75,48.26 71.75,40.01
  pour Top (rank 3): 71.75,48.26 71.75,41.91 64.77,41.91 64.77,48.26
  pour Top: 76.83,40.01 76.83,38.73 72.39,38.73 72.39,37.47 71.12,37.47 71.12,40.01
TSAL_CONTROL
  Top 0.406: U37.3 74.93,29.21 74.3,29.84 TP1.TP
  pour Top: 74.3,27.3 74.3,29.84 81.92,29.84 81.92,26.67 78.74,26.67 78.11,27.3
VBST_5V1
  Top 0.406: U2.8 75.22,44.16 74.3,45.09 C6.1
VCC  (via drill 0.6)
  Top 0.406: U2.3 76.53,39.68 76.83,39.37 v78.11,39.37 | C1.1 65.72,24.45 65.41,24.13
  other vias: 79.38,36.83 79.38,34.29 80.64,34.29 79.38,35.56 80.64,36.83 80.64,35.56
  pour Top (rank 2): 76.2,31.11 82.55,31.11 82.55,42.55 76.83,42.55 76.83,38.1 76.2,38.1
  pour Top: 61.59,24.77 66.04,24.77 68.58,22.23 71.12,22.23 71.12,20.32 61.59,20.32
  pour Top (rank 3, no thermals): 71.12,22.23 71.12,20.32 69.85,19.05 69.85,14.61 76.2,14.61 76.2,20.32 78.11,20.32 78.11,27.3 73.03,27.3 73.03,22.86 72.39,22.23
  pour Route15: 71.75,22.23 71.75,14.61 78.11,14.61 78.11,25.4 82.55,29.84 82.55,42.55 76.83,42.55 76.83,38.73 76.2,38.1 76.2,30.48 73.03,27.3 73.03,23.5
VFB_5V1
  Top 0.406: R2.1 R3.2 76.53,46.95 U2.6

### Text on the board
tPlace: TSMP+ | TSMP- | HV BATT- | HV BATT+ | GLVS | HIGH VOLTAGE | Formula Electric Racing | HIGH VOLTAGE | GLVS | TSAL Control Board V2.0